# Altium schematic sheet CLP_RV_A.1.SchDoc
size 584 x 431 mm; PageSetup: Record=PageOptions|CenterHorizontal=True|CenterVertical=True|PrintScale=0.96|XCorrection=1.00|YCorrection=1.00|PrintKind=0|BorderSize=5000000|LeftOffset=0|BottomOffset=0|Orientation=2|PaperLength=1000|PaperWidth=1000|Scale=100|PaperSource=7|PrintQuality=600|MediaType=1|DitherType=10|PaperKind=Personal. 1:  8,5  x  11 pol|PrintScaleMode=1
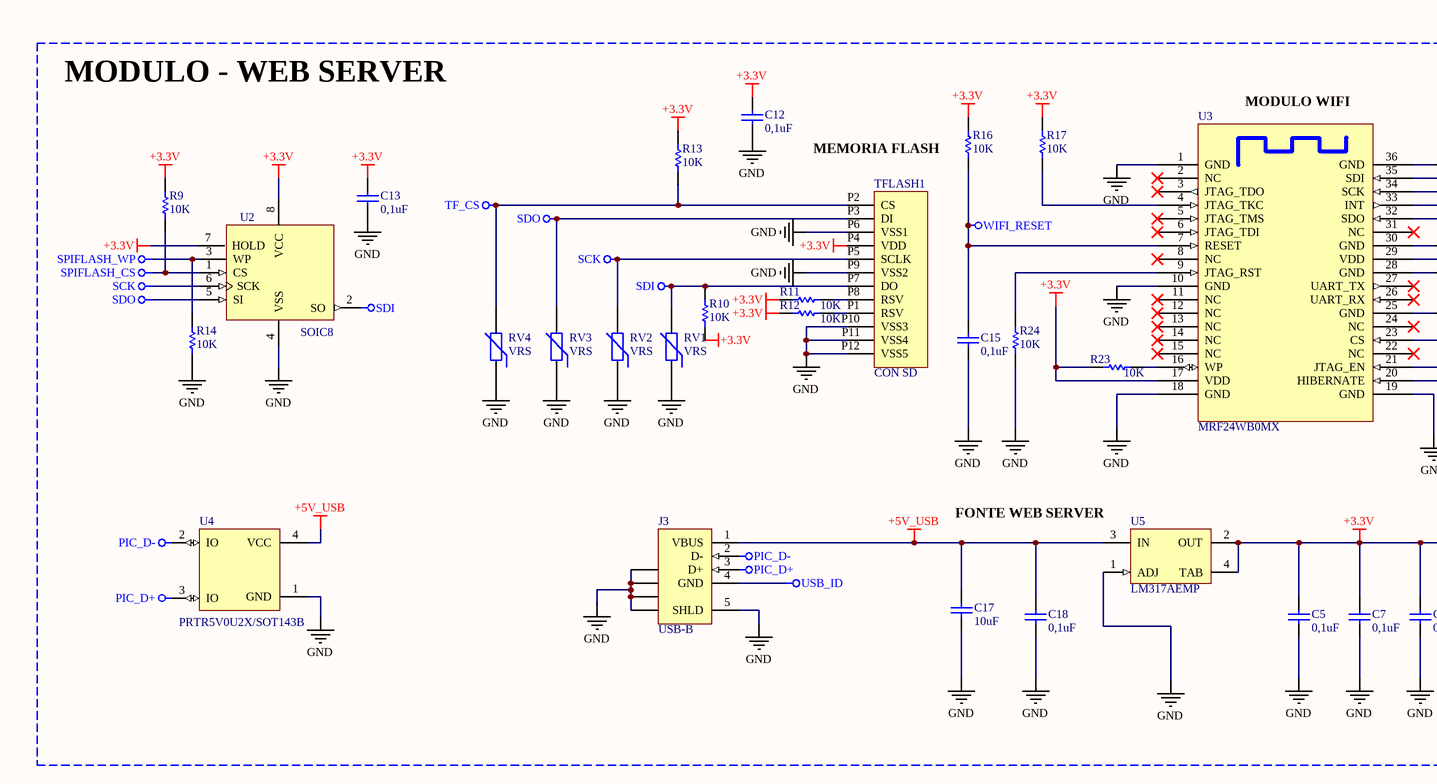
[diagram p0: CLP_RV_A.1.SchDoc, top left]
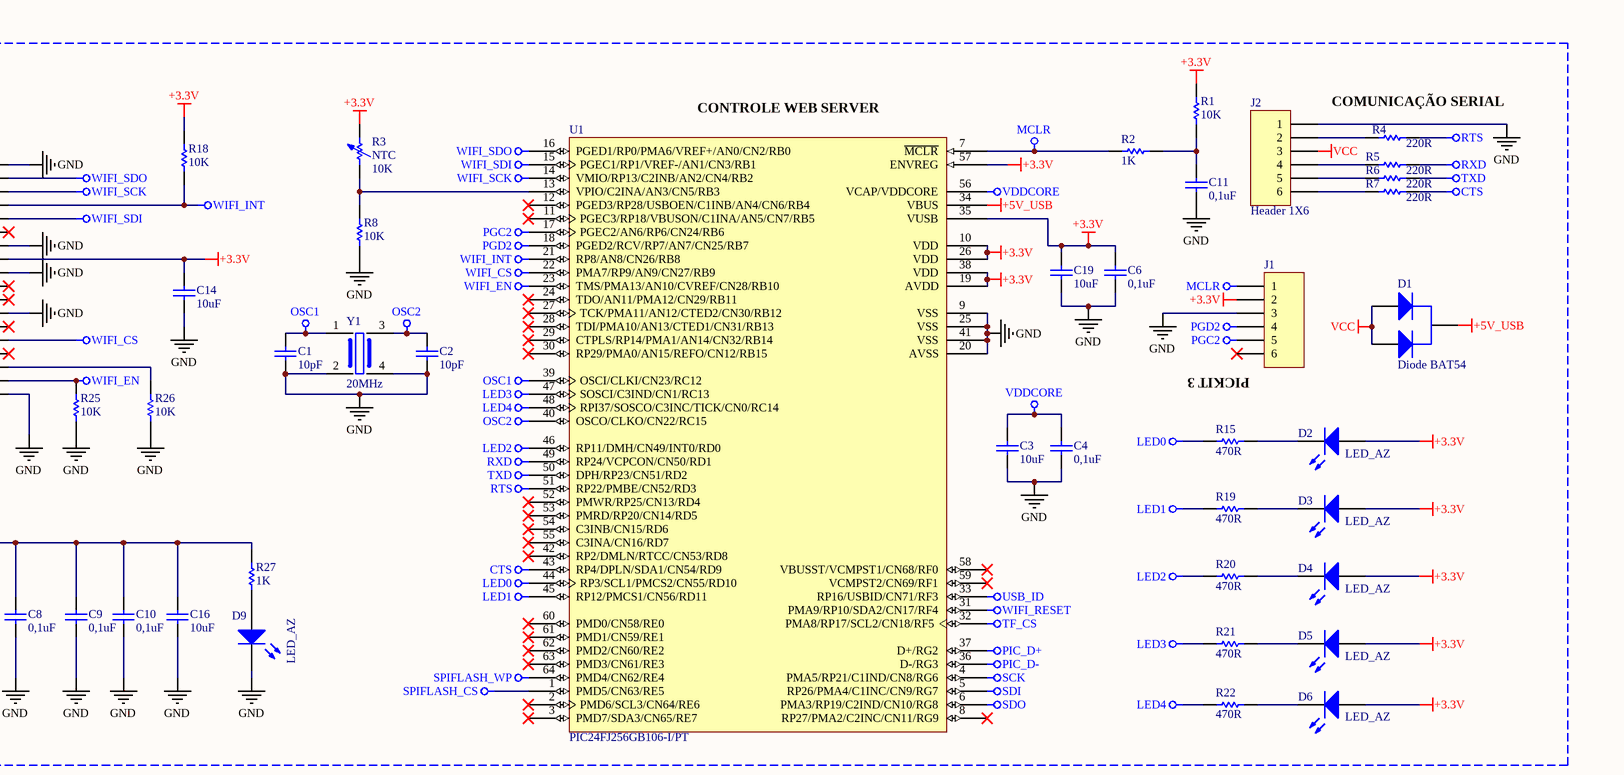
[diagram p1: CLP_RV_A.1.SchDoc, top right]
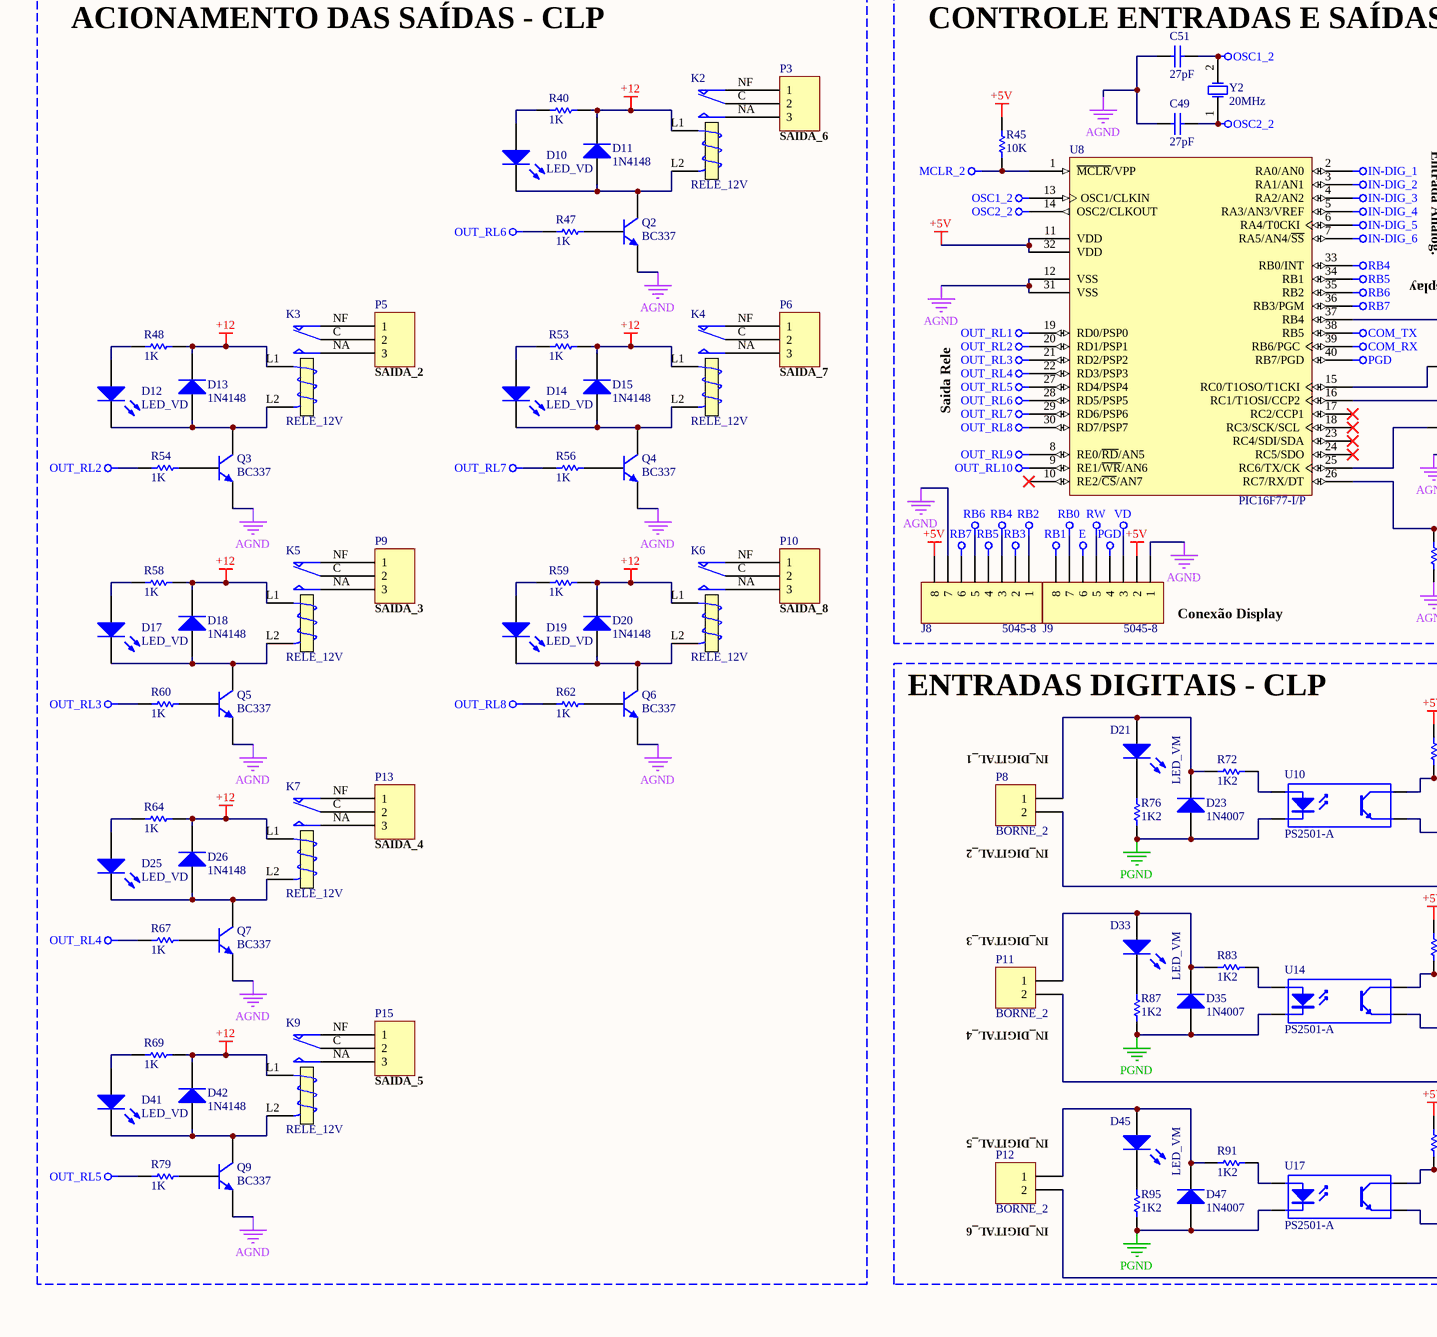
[diagram p2: CLP_RV_A.1.SchDoc, bottom left]
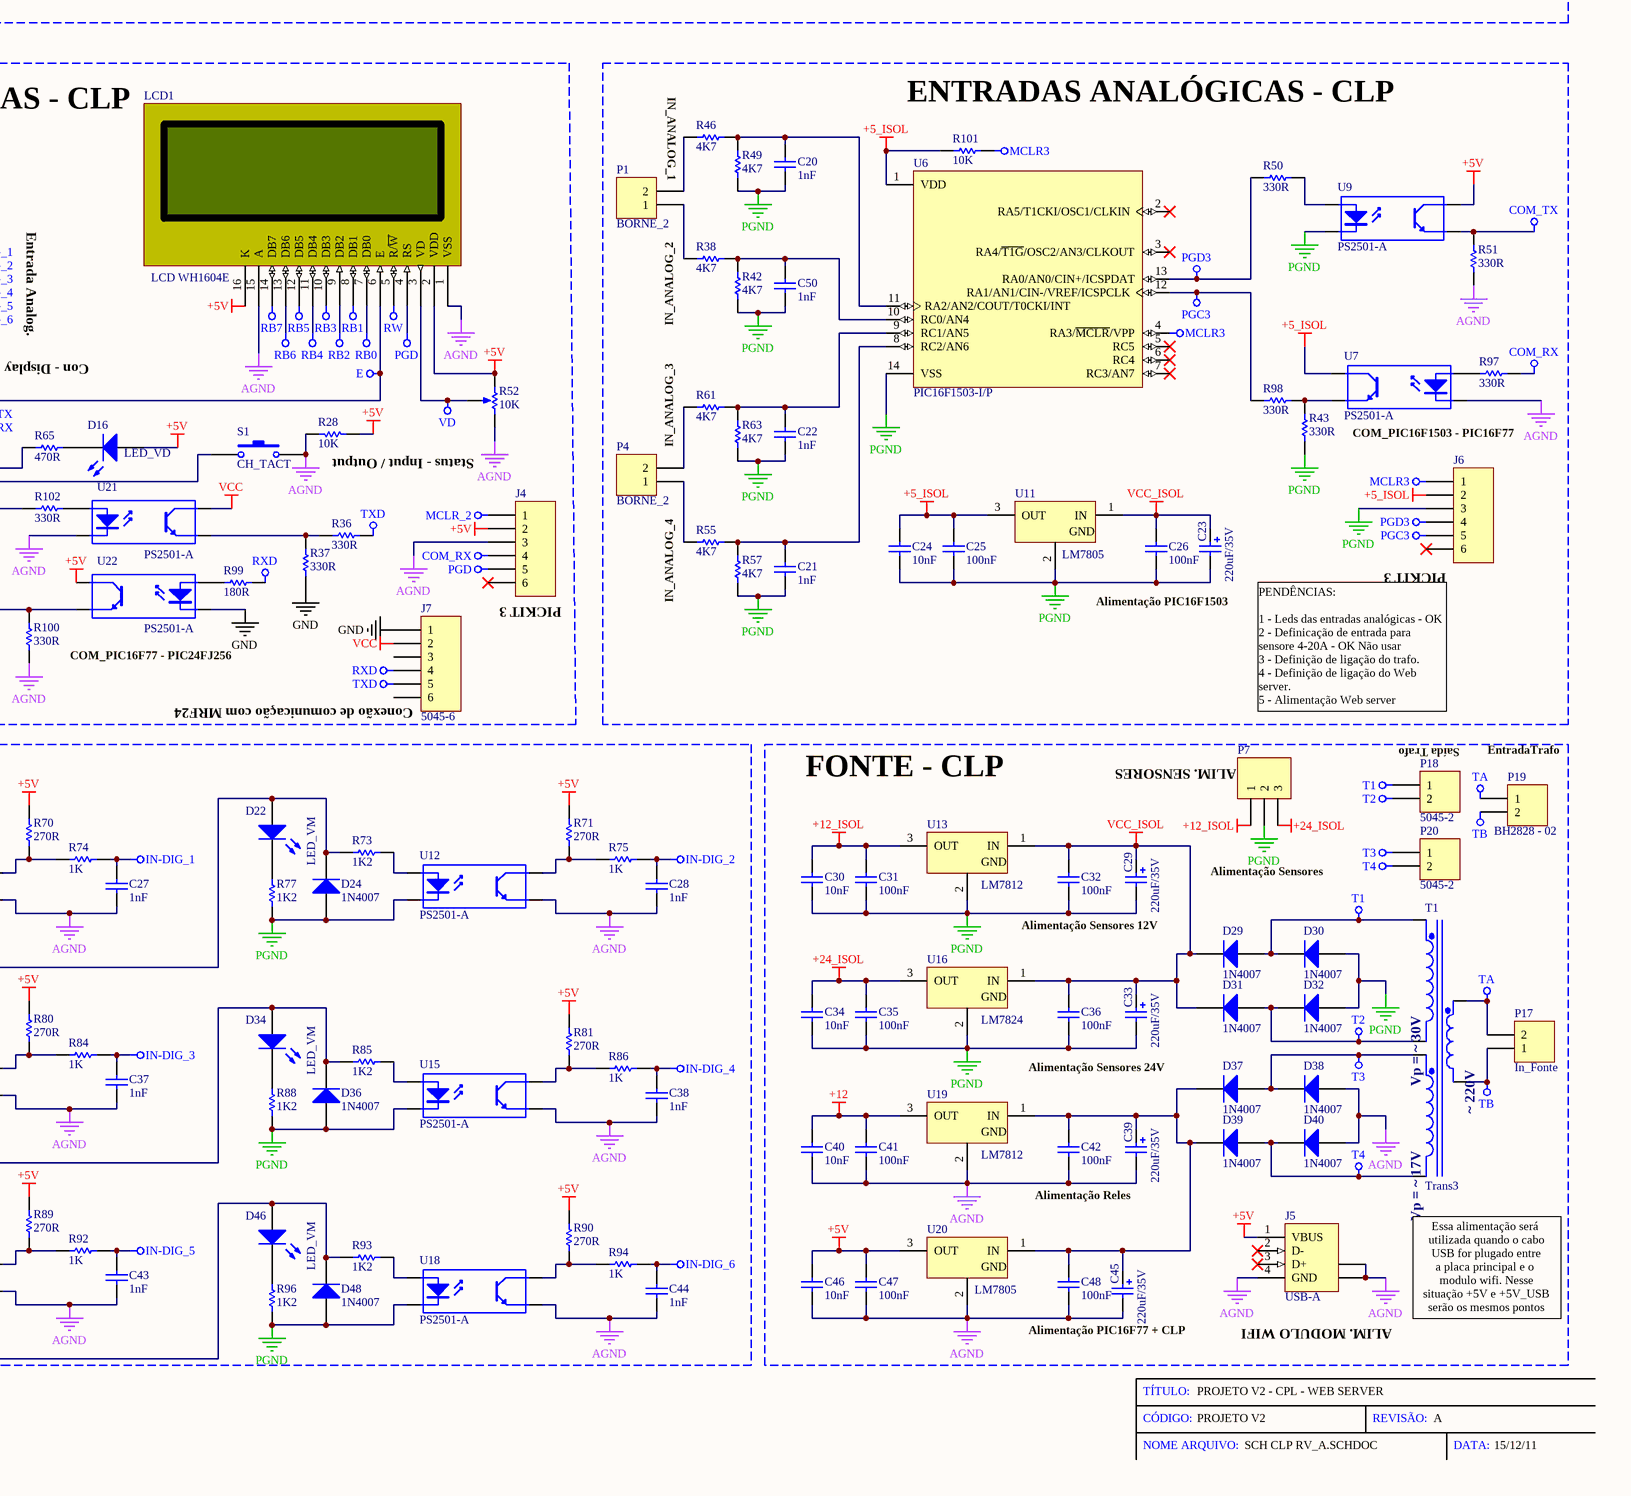
[diagram p3: CLP_RV_A.1.SchDoc, bottom right]

## Parts
C1  10pF  [AR_0603_C]
C2  10pF  [AR_0603_C]
C3  10uF  [AR_0805_C]
C4  0,1uF  [AR_0603_C]
C5  0,1uF  [AR_0603_C]
C6  0,1uF  [AR_0603_C]
C7  0,1uF  [AR_0603_C]
C8  0,1uF  [AR_0603_C]
C9  0,1uF  [AR_0603_C]
C10  0,1uF  [AR_0603_C]
C11  0,1uF  [AR_0603_C]
C12  0,1uF  [AR_0603_C]
C13  0,1uF  [AR_0603_C]
C14  10uF  [AR_0805_C]
C15  0,1uF  [AR_0603_C]
C16  10uF  [AR_0805_C]
C17  10uF  [AR_0805_C]
C18  0,1uF  [AR_0603_C]
C19  10uF  [AR_0805_C]
C20  1nF  [CAP_AX_5_CER]
C21  1nF  [CAP_AX_5_CER]
C22  1nF  [CAP_AX_5_CER]
C23  220uF/35V  [CAP_RD_5_10]
C24  10nF  [CAP_AX_5_CER]
C25  100nF  [CAP_AX_5]
C26  100nF  [CAP_AX_5]
C27  1nF  [CAP_AX_5_CER]
C28  1nF  [CAP_AX_5_CER]
C29  220uF/35V  [CAP_RD_5_10]
C30  10nF  [CAP_AX_5_CER]
C31  100nF  [CAP_AX_5]
C32  100nF  [CAP_AX_5]
C33  220uF/35V  [CAP_RD_5_10]
C34  10nF  [CAP_AX_5_CER]
C35  100nF  [CAP_AX_5]
C36  100nF  [CAP_AX_5]
C37  1nF  [CAP_AX_5_CER]
C38  1nF  [CAP_AX_5_CER]
C39  220uF/35V  [CAP_RD_5_10]
C40  10nF  [CAP_AX_5_CER]
C41  100nF  [CAP_AX_5]
C42  100nF  [CAP_AX_5]
C43  1nF  [CAP_AX_5_CER]
C44  1nF  [CAP_AX_5_CER]
C45  220uF/35V  [CAP_RD_5_10]
C46  10nF  [CAP_AX_5_CER]
C47  100nF  [CAP_AX_5]
C48  100nF  [CAP_AX_5]
C49  27pF  [CAP_AX_5_CER]
C50  1nF  [CAP_AX_5_CER]
C51  27pF  [CAP_AX_5_CER]
D1  Diode BAT54  [AR_SOT23]
D2  LED_AZ  [AR_0603_L_AZ]
D3  LED_AZ  [AR_0603_L_AZ]
D4  LED_AZ  [AR_0603_L_AZ]
D5  LED_AZ  [AR_0603_L_AZ]
D6  LED_AZ  [AR_0603_L_AZ]
D9  LED_AZ  [AR_0603_L_AZ]
D10  LED_VD  [LED_VD]
D11  1N4148  [1N414X]
D12  LED_VD  [LED_VD]
D13  1N4148  [1N414X]
D14  LED_VD  [LED_VD]
D15  1N4148  [1N414X]
D16  LED_VD  [LED_VD]
D17  LED_VD  [LED_VD]
D18  1N4148  [1N414X]
D19  LED_VD  [LED_VD]
D20  1N4148  [1N414X]
D21  LED_VM  [LED_VM]
D22  LED_VM  [LED_VM]
D23  1N4007  [1N400X]
D24  1N4007  [1N400X]
D25  LED_VD  [LED_VD]
D26  1N4148  [1N414X]
D29  1N4007  [1N400X]
D30  1N4007  [1N400X]
D31  1N4007  [1N400X]
D32  1N4007  [1N400X]
D33  LED_VM  [LED_VM]
D34  LED_VM  [LED_VM]
D35  1N4007  [1N400X]
D36  1N4007  [1N400X]
D37  1N4007  [1N400X]
D38  1N4007  [1N400X]
D39  1N4007  [1N400X]
D40  1N4007  [1N400X]
D41  LED_VD  [LED_VD]
D42  1N4148  [1N414X]
D45  LED_VM  [LED_VM]
D46  LED_VM  [LED_VM]
D47  1N4007  [1N400X]
D48  1N4007  [1N400X]
J1  Header 1X6  [BARRA DE PINO RETA 1 X 7]  (value not drawn)
J2  Header 1X6  [BARRA DE PINO RETA 1 X 7]
J3  USB-B  [CON_USB_SMD_B]
J4  PICKIT 3  [BARRA DE PINO RETA 1 X 7]  (value not drawn)
J5  USB-A  [CON_USB_PTH_A]
J6  PICKIT 3  [BARRA DE PINO RETA 1 X 7]  (value not drawn)
J7  5045-6  [BC5045-06]
J8  5045-8  [BC5045-08]
J9  5045-8  [BC5045-08]
K2  RELE_12V  [RELE_M]
K3  RELE_12V  [RELE_M]
K4  RELE_12V  [RELE_M]
K5  RELE_12V  [RELE_M]
K6  RELE_12V  [RELE_M]
K7  RELE_12V  [RELE_M]
K9  RELE_12V  [RELE_M]
LCD1  LCD WH1604E  [WH1604]
P1  BORNE_2  [BORNE_2]
P3  SAIDA_6  [BORNE_3]
P4  BORNE_2  [BORNE_2]
P5  SAIDA_2  [BORNE_3]
P6  SAIDA_7  [BORNE_3]
P7  Alimentação Sensores  [BORNE_3]
P8  BORNE_2  [BORNE_2]
P9  SAIDA_3  [BORNE_3]
P10  SAIDA_8  [BORNE_3]
P11  BORNE_2  [BORNE_2]
P12  BORNE_2  [BORNE_2]
P13  SAIDA_4  [BORNE_3]
P15  SAIDA_5  [BORNE_3]
P17  In_Fonte  [BORNE_2]
P18  5045-2  [BC5045-02]
P19  BH2828 - 02  [BOX_HEAD_2828-02]
P20  5045-2  [BC5045-02]
Q2  BC337  [TO-92]
Q3  BC337  [TO-92]
Q4  BC337  [TO-92]
Q5  BC337  [TO-92]
Q6  BC337  [TO-92]
Q7  BC337  [TO-92]
Q9  BC337  [TO-92]
R1  10K  [AR_0603_R]
R2  1K  [AR_0603_R]
R3  NTC  value 10K  [AR_0603_I]
R4  220R  [AR_0603_R]
R5  220R  [AR_0603_R]
R6  220R  [AR_0603_R]
R7  220R  [AR_0603_R]
R8  10K  [AR_0603_R]
R9  10K  [AR_0603_R]
R10  10K  [AR_0603_R]
R11  10K  [AR_0603_R]
R12  10K  [AR_0603_R]
R13  10K  [AR_0603_R]
R14  10K  [AR_0603_R]
R15  470R  [AR_0603_R]
R16  10K  [AR_0603_R]
R17  10K  [AR_0603_R]
R18  10K  [AR_0603_R]
R19  470R  [AR_0603_R]
R20  470R  [AR_0603_R]
R21  470R  [AR_0603_R]
R22  470R  [AR_0603_R]
R23  10K  [AR_0603_R]
R24  10K  [AR_0603_R]
R25  10K  [AR_0603_R]
R26  10K  [AR_0603_R]
R27  1K  [AR_0603_R]
R28  10K  [R20]
R36  value 330R  [R20]  (hidden comment: 4K7)
R37  value 330R  [R20]  (hidden comment: 4K7)
R38  4K7  [R20]
R40  1K  [R20]
R42  4K7  [R20]
R43  value 330R  [R20]  (hidden comment: 4K7)
R45  10K  [R20]
R46  4K7  [R20]
R47  1K  [R20]
R48  1K  [R20]
R49  4K7  [R20]
R50  value 330R  [R20]  (hidden comment: 4K7)
R51  value 330R  [R20]  (hidden comment: 4K7)
R52  10K  [POT_G]
R53  1K  [R20]
R54  1K  [R20]
R55  4K7  [R20]
R56  1K  [R20]
R57  4K7  [R20]
R58  1K  [R20]
R59  1K  [R20]
R60  1K  [R20]
R61  4K7  [R20]
R62  1K  [R20]
R63  4K7  [R20]
R64  1K  [R20]
R65  value 470R  [R20]  (hidden comment: 4K7)
R67  1K  [R20]
R69  1K  [R20]
R70  value 270R  [R20]  (hidden comment: 4K7)
R71  value 270R  [R20]  (hidden comment: 4K7)
R72  value 1K2  [R20]  (hidden comment: 4K7)
R73  value 1K2  [R20]  (hidden comment: 4K7)
R74  1K  [R20]
R75  1K  [R20]
R76  value 1K2  [R20]  (hidden comment: 4K7)
R77  value 1K2  [R20]  (hidden comment: 4K7)
R79  1K  [R20]
R80  value 270R  [R20]  (hidden comment: 4K7)
R81  value 270R  [R20]  (hidden comment: 4K7)
R83  value 1K2  [R20]  (hidden comment: 4K7)
R84  1K  [R20]
R85  value 1K2  [R20]  (hidden comment: 4K7)
R86  1K  [R20]
R87  value 1K2  [R20]  (hidden comment: 4K7)
R88  value 1K2  [R20]  (hidden comment: 4K7)
R89  value 270R  [R20]  (hidden comment: 4K7)
R90  value 270R  [R20]  (hidden comment: 4K7)
R91  value 1K2  [R20]  (hidden comment: 4K7)
R92  1K  [R20]
R93  value 1K2  [R20]  (hidden comment: 4K7)
R94  1K  [R20]
R95  value 1K2  [R20]  (hidden comment: 4K7)
R96  value 1K2  [R20]  (hidden comment: 4K7)
R97  value 330R  [R20]  (hidden comment: 4K7)
R98  value 330R  [R20]  (hidden comment: 4K7)
R99  180R  [R20]
R100  value 330R  [R20]  (hidden comment: 4K7)
R101  10K  [R20]
R102  value 330R  [R20]  (hidden comment: 4K7)
RV1  VRS  [0402_MOV]
RV2  VRS  [0402_MOV]
RV3  VRS  [0402_MOV]
RV4  VRS  [0402_MOV]
S1  CH_TACT  [PUSH]
T1  Trans3  [TRF_6]
TFLASH1  CON SD  [MEM2060]
U1  PIC24FJ256GB106-I/PT  [AR_TQFP64]
U2  SOIC8  [AR_SO8]
U3  MRF24WB0MX  [MRF24WB0MA]
U4  PRTR5V0U2X/SOT143B  [SOT143B]
U5  LM317AEMP  [SOT223]
U6  PIC16F1503-I/P  [DIP14]
U7  PS2501-A  [DIP-4]
U8  PIC16F77-I/P  [DIP40]
U9  PS2501-A  [DIP-4]
U10  PS2501-A  [DIP-4]
U11  LM7805  [TO220]
U12  PS2501-A  [DIP-4]
U13  LM7812  [TO220]
U14  PS2501-A  [DIP-4]
U15  PS2501-A  [DIP-4]
U16  LM7824  [TO220]
U17  PS2501-A  [DIP-4]
U18  PS2501-A  [DIP-4]
U19  LM7812  [TO220]
U20  LM7805  [TO220]
U21  PS2501-A  [DIP-4]
U22  PS2501-A  [DIP-4]
Y1  20MHz  [XTAL_SMD_KX6]
Y2  20MHz  [XTAL]

## Blocks framed on the sheet
MODULO - WEB SERVER: C1-C19 D1-D6 D9 J1-J3 R1-R27 RV1-RV4 TFLASH1 U1-U5 Y1
ACIONAMENTO DAS SAÍDAS - CLP: D10-D15 D17-D20 D25 D26 D41 D42 K2-K7 K9 P3 P5 P6 P9 P10 P13 P15 Q2-Q7 Q9 R40 R47 R48 R53 R54 R56 R58-R60 R62 R64 R67 R69 R79
CONTROLE ENTRADAS E SAÍDAS - CLP: C49 C51 D16 J4 J7-J9 LCD1 R28 R36 R37 R45 R52 R65 R99 R100 R102 S1 U8 U21 U22 Y2
ENTRADAS ANALÓGICAS - CLP: C20-C26 C50 J6 P1 P4 R38 R42 R43 R46 R49-R51 R55 R57 R61 R63 R97 R98 R101 U6 U7 U9 U11
ENTRADAS DIGITAIS - CLP: C27 C28 C37 C38 C43 C44 D21-D24 D33-D36 D45-D48 P8 P11 P12 R70-R77 R80 R81 R83-R96 U10 U12 U14 U15 U17 U18
FONTE - CLP: C29-C36 C39-C42 C45-C48 D29-D32 D37-D40 J5 P7 P17-P20 T1 U13 U16 U19 U20

## Nets
+3.3V: C5.2 C6.2 C7.2 C8.2 C9.2 C10.2 C12.2 C13.2 C14.2 C16.2 C19.2 D2.1(A) D3.1(A) D4.1(A) D5.1(A) D6.1(A) J1.2 R1.2 R3.2 R9.2 R10.1 R11.1 R12.1 R13.2 R16.2 R17.2 R18.2 R23.2 R27.2 TFLASH1.P4(VDD) U1.10(VDD) U1.19(AVDD) U1.26(VDD) U1.35(VUSB) U1.38(VDD) U1.57(ENVREG) U2.7(HOLD) U2.8(VCC) U3.17(VDD) U3.29(VDD) U5.2(OUT) U5.4(TAB)
+5_ISOL: C24.2 C25.2 J6.2 R101.1 U6.1(VDD) U7.4(C) U11.3(OUT)
+5V: C46.2 C47.2 D16.1(A) J4.2 J5.1(VBUS) J8.8 J9.2 LCD1.2(VDD) LCD1.16(K) R28.2 R45.2 R52.1(TOP) R70.2 R71.2 R80.2 R81.2 R89.2 R90.2 U8.11(VDD) U8.32(VDD) U9.4(C) U20.3(OUT) U22.4(C)
+5V_USB: C17.2 C18.2 D1.3(K) J3.1(VBUS) U1.34(VBUS) U4.4(VCC) U5.3(IN)
+12: C40.2 C41.2 D11.2(K) D13.2(K) D15.2(K) D18.2(K) D20.2(K) D26.2(K) D42.2(K) K2.L1(T1) K3.L1(T1) K4.L1(T1) K5.L1(T1) K6.L1(T1) K7.L1(T1) K9.L1(T1) R40.2 R48.2 R53.2 R58.2 R59.2 R64.2 R69.2 U19.3(OUT)
+12_ISOL: C30.2 C31.2 P7.1 U13.3(OUT)
+24_ISOL: C34.2 C35.2 P7.3 U16.3(OUT)
AGND: C27.1 C28.1 C37.1 C38.1 C39.2 C40.1 C41.1 C42.1 C43.1 C44.1 C45.2 C46.1 C47.1 C48.1 C49.1 C51.1 D38.1(A) D40.1(A) J4.3 J5.4(GND) J5.5(SHLD) J5.6(SHLD) J8.7 J9.1 LCD1.1(VSS) LCD1.15(A) Q2.E Q3.E Q4.E Q5.E Q6.E Q7.E Q9.E R28.1 R51.2 R52.2(BOT) R100.2 S1.2 U7.2(K) U8.12(VSS) U8.31(VSS) U10.3(E) U12.3(E) U14.3(E) U15.3(E) U17.3(E) U18.3(E) U19.2(GND) U20.2(GND) U21.2(K)
COM_RX: J4.4 R97.1 U8.39(RB6/PGC)
COM_TX: R51.1 U8.38(RB5) U9.3(E)
CTS: R7.2 U1.43(RP4/DPLN/SDA1/CN54/RD9)
E: J9.6 LCD1.6(E) U8.37(RB4)
GND: C1.1 C2.1 C3.1 C4.1 C5.1 C6.1 C7.1 C8.1 C9.1 C10.1 C11.1 C12.1 C13.1 C14.1 C15.1 C16.1 C17.1 C18.1 C19.1 D9.2(K) J1.3 J2.1 J3.5(SHLD) J3.6(SHLD) J3.7(SHLD) J3.8(SHLD) J3.9(SHLD) J7.1 R8.1 R14.1 R24.1 R25.1 R26.1 R37.2 RV1.1 RV2.1 RV3.1 RV4.1 TFLASH1.P6(VSS1) TFLASH1.P9(VSS2) TFLASH1.P10(VSS3) TFLASH1.P11(VSS4) TFLASH1.P12(VSS5) U1.9(VSS) U1.20(AVSS) U1.25(VSS) U1.41(VSS) U2.4(VSS) U3.1(GND) U3.10(GND) U3.18(GND) U3.19(GND) U3.25(GND) U3.28(GND) U3.30(GND) U3.36(GND) U4.1(GND) U5.1(ADJ) U22.2(K) Y1.2(OSC2) Y1.4(OSC4)
IN-DIG_1: C27.2 R74.2 U8.2(RA0/AN0)
IN-DIG_2: C28.2 R75.2 U8.3(RA1/AN1)
IN-DIG_3: C37.2 R84.2 U8.4(RA2/AN2)
IN-DIG_4: C38.2 R86.2 U8.5(RA3/AN3/VREF)
IN-DIG_5: C43.2 R92.2 U8.6(RA4/T0CKI)
IN-DIG_6: C44.2 R94.2 U8.7(RA5/AN4/~{SS})
LED0: R15.1 U1.44(RP3/SCL1/PMCS2/CN55/RD10)
LED1: R19.1 U1.45(RP12/PMCS1/CN56/RD11)
LED2: R20.1 U1.46(RP11/DMH/CN49/INT0/RD0)
LED3: R21.1 U1.47(SOSCI/C3IND/CN1/RC13)
LED4: R22.1 U1.48(RPI37/SOSCO/C3INC/TICK/CN0/RC14)
MCLR: J1.1 R2.1 U1.7(~{MCLR})
MCLR3: J6.1 R101.2 U6.4(RA3/~{MCLR}/VPP)
MCLR_2: J4.1 R45.1 U8.1(~{MCLR}/VPP)
OSC1: C1.2 U1.39(OSCI/CLKI/CN23/RC12) Y1.1(OSC1)
OSC1_2: C51.2 U8.13(OSC1/CLKIN) Y2.2(OSC2)
OSC2: C2.2 U1.40(OSCO/CLKO/CN22/RC15) Y1.3(OSC3)
OSC2_2: C49.2 U8.14(OSC2/CLKOUT) Y2.1(OSC1)
OUT_RL1: U8.19(RD0/PSP0)
OUT_RL2: R54.1 U8.20(RD1/PSP1)
OUT_RL3: R60.1 U8.21(RD2/PSP2)
OUT_RL4: R67.1 U8.22(RD3/PSP3)
OUT_RL5: R79.1 U8.27(RD4/PSP4)
OUT_RL6: R47.1 U8.28(RD5/PSP5)
OUT_RL7: R56.1 U8.29(RD6/PSP6)
OUT_RL8: R62.1 U8.30(RD7/PSP7)
OUT_RL9: U8.8(RE0/~{RD}/AN5)
OUT_RL10: U8.9(RE1/~{WR}/AN6)
PGC2: J1.5 U1.17(PGEC2/AN6/RP6/CN24/RB6)
PGC3: J6.5 R98.2 U6.12(RA1/AN1/CIN-/VREF/ICSPCLK)
PGD: J4.5 J9.4 LCD1.4(RS) U8.40(RB7/PGD)
PGD2: J1.4 U1.18(PGED2/RCV/RP7/AN7/CN25/RB7)
PGD3: J6.4 R50.2 U6.13(RA0/AN0/CIN+/ICSPDAT)
PGND: C20.1 C21.1 C22.1 C23.2 C24.1 C25.1 C26.1 C29.2 C30.1 C31.1 C32.1 C33.2 C34.1 C35.1 C36.1 C50.1 D23.1(A) D24.1(A) D30.1(A) D32.1(A) D35.1(A) D36.1(A) D47.1(A) D48.1(A) J6.3 P7.2 R42.1 R43.1 R49.1 R57.2 R63.2 R76.1 R77.1 R87.1 R88.1 R95.1 R96.1 U6.14(VSS) U9.2(K) U10.2(K) U11.2(GND) U12.2(K) U13.2(GND) U14.2(K) U15.2(K) U16.2(GND) U17.2(K) U18.2(K)
PIC_D+: J3.3(D+) U1.37(D+/RG2) U4.3(IO)
PIC_D-: J3.2(D-) U1.36(D-/RG3) U4.2(IO)
RB0: J9.7 LCD1.7(DB0)
RB1: J9.8 LCD1.8(DB1)
RB2: J8.1 LCD1.9(DB2)
RB3: J8.2 LCD1.10(DB3)
RB4: J8.3 LCD1.11(DB4) U8.33(RB0/INT)
RB5: J8.4 LCD1.12(DB5) U8.34(RB1)
RB6: J8.5 LCD1.13(DB6) U8.35(RB2)
RB7: J8.6 LCD1.14(DB7) U8.36(RB3/PGM)
RTS: R4.2 U1.51(RP22/PMBE/CN52/RD3)
RW: J9.5 LCD1.5(R/~{W})
RXD: J7.4 R5.2 R99.2 U1.49(RP24/VCPCON/CN50/RD1)
SCK: RV2.2 TFLASH1.P5(SCLK) U1.4(PMA5/RP21/C1IND/CN8/RG6) U2.6(SCK)
SDI: R10.2 RV1.2 TFLASH1.P7(DO) U1.5(RP26/PMA4/C1INC/CN9/RG7) U2.2(SO)
SDO: RV3.2 TFLASH1.P3(DI) U1.6(PMA3/RP19/C2IND/CN10/RG8) U2.5(SI)
SPIFLASH_CS: R9.1 U1.1(PMD5/CN63/RE5) U2.1(CS)
SPIFLASH_WP: R14.2 U1.64(PMD4/CN62/RE4) U2.3(WP)
T1: D29.1(A) D30.2(K) P18.1 T1.3(Sec1+)
T2: D31.1(A) D32.2(K) P18.2 T1.4(Sec1-)
T3: D37.1(A) D38.2(K) P20.1 T1.5(Sec2+)
T4: D39.1(A) D40.2(K) P20.2 T1.6(Sec2-)
TA: P17.2 P19.1 T1.1(Pri+)
TB: P17.1 P19.2 T1.2(Pri-)
TF_CS: R13.1 RV4.2 TFLASH1.P2(CS) U1.32(PMA8/RP17/SCL2/CN18/RF5)
TXD: J7.5 R6.2 R36.1 U1.50(DPH/RP23/CN51/RD2)
USB_ID: J3.4(GND) U1.33(RP16/USBID/CN71/RF3)
VCC: D1.1(A) D1.2(A) J2.3 J7.2 U21.4(C)
VCC_ISOL: C23.1 C26.2 C29.1 C32.2 C33.1 C36.2 D29.2(K) D31.2(K) U11.1(IN) U13.1(IN) U16.1(IN)
VD: J9.3 LCD1.3(VD) R52.3(TAP)
VDDCORE: C3.2 C4.2 U1.56(VCAP/VDDCORE)
WIFI_CS: U1.22(PMA7/RP9/AN9/CN27/RB9) U3.23(CS)
WIFI_EN: R25.2 U1.23(TMS/PMA13/AN10/CVREF/CN28/RB10) U3.20(HIBERNATE)
WIFI_INT: R18.1 U1.21(RP8/AN8/CN26/RB8) U3.33(INT)
WIFI_RESET: C15.2 R16.1 U1.31(PMA9/RP10/SDA2/CN17/RF4) U3.7(RESET)
WIFI_SCK: U1.14(VMIO/RP13/C2INB/AN2/CN4/RB2) U3.34(SCK)
WIFI_SDI: U1.15(PGEC1/RP1/VREF-/AN1/CN3/RB1) U3.32(SDO)
WIFI_SDO: U1.16(PGED1/RP0/PMA6/VREF+/AN0/CN2/RB0) U3.35(SDI)
NetC11_2: C11.2 R1.1 R2.2
NetC20_2: C20.2 R46.2 R49.2 U6.11(RA2/AN2/COUT/T0CKI/INT)
NetC21_2: C21.2 R55.2 R57.1 U6.8(RC2/AN6)
NetC22_2: C22.2 R61.2 R63.1 U6.9(RC1/AN5)
NetC39_1: C39.1 C42.2 C45.1 C48.2 D37.2(K) D39.2(K) U19.1(IN) U20.1(IN)
NetC50_2: C50.2 R38.2 R42.2 U6.10(RC0/AN4)
NetD2_2: D2.2(K) R15.2
NetD3_2: D3.2(K) R19.2
NetD4_2: D4.2(K) R20.2
NetD5_2: D5.2(K) R21.2
NetD6_2: D6.2(K) R22.2
NetD9_1: D9.1(A) R27.1
NetD10_1: D10.1(A) R40.1
NetD10_2: D10.2(K) D11.1(A) K2.L2(T2) Q2.C
NetD12_1: D12.1(A) R48.1
NetD12_2: D12.2(K) D13.1(A) K3.L2(T2) Q3.C
NetD14_1: D14.1(A) R53.1
NetD14_2: D14.2(K) D15.1(A) K4.L2(T2) Q4.C
NetD16_2: D16.2(K) R65.2
NetD17_1: D17.1(A) R58.1
NetD17_2: D17.2(K) D18.1(A) K5.L2(T2) Q5.C
NetD19_1: D19.1(A) R59.1
NetD19_2: D19.2(K) D20.1(A) K6.L2(T2) Q6.C
NetD21_1: D21.1(A) D23.2(K) P8.1 R72.1
NetD21_2: D21.2(K) R76.2
NetD22_1: D22.1(A) D24.2(K) P8.2 R73.1
NetD22_2: D22.2(K) R77.2
NetD25_1: D25.1(A) R64.1
NetD25_2: D25.2(K) D26.1(A) K7.L2(T2) Q7.C
NetD33_1: D33.1(A) D35.2(K) P11.1 R83.1
NetD33_2: D33.2(K) R87.2
NetD34_1: D34.1(A) D36.2(K) P11.2 R85.1
NetD34_2: D34.2(K) R88.2
NetD41_1: D41.1(A) R69.1
NetD41_2: D41.2(K) D42.1(A) K9.L2(T2) Q9.C
NetD45_1: D45.1(A) D47.2(K) P12.1 R91.1
NetD45_2: D45.2(K) R95.2
NetD46_1: D46.1(A) D48.2(K) P12.2 R93.1
NetD46_2: D46.2(K) R96.2
NetJ2_2: J2.2 R4.1
NetJ2_4: J2.4 R5.1
NetJ2_5: J2.5 R6.1
NetJ2_6: J2.6 R7.1
NetK2_C: K2.C(COM) P3.2
NetK2_NA: K2.NA(NO) P3.3
NetK2_NF: K2.NF(NC) P3.1
NetK3_C: K3.C(COM) P5.2
NetK3_NA: K3.NA(NO) P5.3
NetK3_NF: K3.NF(NC) P5.1
NetK4_C: K4.C(COM) P6.2
NetK4_NA: K4.NA(NO) P6.3
NetK4_NF: K4.NF(NC) P6.1
NetK5_C: K5.C(COM) P9.2
NetK5_NA: K5.NA(NO) P9.3
NetK5_NF: K5.NF(NC) P9.1
NetK6_C: K6.C(COM) P10.2
NetK6_NA: K6.NA(NO) P10.3
NetK6_NF: K6.NF(NC) P10.1
NetK7_C: K7.C(COM) P13.2
NetK7_NA: K7.NA(NO) P13.3
NetK7_NF: K7.NF(NC) P13.1
NetK9_C: K9.C(COM) P15.2
NetK9_NA: K9.NA(NO) P15.3
NetK9_NF: K9.NF(NC) P15.1
NetP1_1: P1.1 R38.1
NetP1_2: P1.2 R46.1
NetP4_1: P4.1 R55.1
NetP4_2: P4.2 R61.1
NetQ2_B: Q2.B R47.2
NetQ3_B: Q3.B R54.2
NetQ4_B: Q4.B R56.2
NetQ5_B: Q5.B R60.2
NetQ6_B: Q6.B R62.2
NetQ7_B: Q7.B R67.2
NetQ9_B: Q9.B R79.2
NetR3_1: R3.1 R8.2 U1.13(VPIO/C2INA/AN3/CN5/RB3)
NetR11_2: R11.2 TFLASH1.P8(RSV)
NetR12_2: R12.2 TFLASH1.P1(RSV)
NetR17_1: R17.1 U3.4(JTAG_TKC)
NetR23_1: R23.1 U3.16(WP)
NetR24_2: R24.2 U3.9(JTAG_RST)
NetR26_2: R26.2 U3.21(JTAG_EN)
NetR36_2: R36.2 R37.1 U21.3(E)
NetR43_2: R43.2 R98.1 U7.3(E)
NetR50_1: R50.1 U9.1(A)
NetR65_1: R65.1 U8.15(RC0/T1OSO/T1CKI)
NetR70_1: R70.1 R74.1 U10.4(C)
NetR71_1: R71.1 R75.1 U12.4(C)
NetR72_2: R72.2 U10.1(A)
NetR73_2: R73.2 U12.1(A)
NetR80_1: R80.1 R84.1 U14.4(C)
NetR81_1: R81.1 R86.1 U15.4(C)
NetR83_2: R83.2 U14.1(A)
NetR85_2: R85.2 U15.1(A)
NetR89_1: R89.1 R92.1 U17.4(C)
NetR90_1: R90.1 R94.1 U18.4(C)
NetR91_2: R91.2 U17.1(A)
NetR93_2: R93.2 U18.1(A)
NetR97_2: R97.2 U7.1(A)
NetR99_1: R99.1 U22.1(A)
NetR100_1: R100.1 U8.26(RC7/RX/DT) U22.3(E)
NetR102_1: R102.1 U21.1(A)
NetR102_2: R102.2 U8.25(RC6/TX/CK)
NetS1_1: S1.1 U8.16(RC1/T1OSI/CCP2)

Not connected (* = marked no-connect by the designer): J1 6*; J4 6*; J5 2(D-)* 3(D+)*; J6 6*; J7 3 6; U1 2(PMD6/SCL3/CN64/RE6)* 3(PMD7/SDA3/CN65/RE7)* 8(RP27/PMA2/C2INC/CN11/RG9)* 11(PGEC3/RP18/VBUSON/C1INA/AN5/CN7/RB5)* 12(PGED3/RP28/USBOEN/C1INB/AN4/CN6/RB4)* 24(TDO/AN11/PMA12/CN29/RB11)* 27(TCK/PMA11/AN12/CTED2/CN30/RB12)* 28(TDI/PMA10/AN13/CTED1/CN31/RB13)* 29(CTPLS/RP14/PMA1/AN14/CN32/RB14)* 30(RP29/PMA0/AN15/REFO/CN12/RB15)* 42(RP2/DMLN/RTCC/CN53/RD8)* 52(PMWR/RP25/CN13/RD4)* 53(PMRD/RP20/CN14/RD5)* 54(C3INB/CN15/RD6)* 55(C3INA/CN16/RD7)* 58(VBUSST/VCMPST1/CN68/RF0)* 59(VCMPST2/CN69/RF1)* 60(PMD0/CN58/RE0)* 61(PMD1/CN59/RE1)* 62(PMD2/CN60/RE2)* 63(PMD3/CN61/RE3)*; U3 2(NC)* 3(JTAG_TDO)* 5(JTAG_TMS)* 6(JTAG_TDI)* 8(NC)* 11(NC)* 12(NC)* 13(NC)* 14(NC)* 15(NC)* 22(NC)* 24(NC)* 26(UART_RX)* 27(UART_TX)* 31(NC)*; U6 2(RA5/T1CKI/OSC1/CLKIN)* 3(RA4/~{T1G}/OSC2/AN3/CLKOUT)* 5(RC5)* 6(RC4)* 7(RC3/AN7)*; U8 10(RE2/~{CS}/AN7)* 17(RC2/CCP1)* 18(RC3/SCK/SCL)* 23(RC4/SDI/SDA)* 24(RC5/SDO)*

## Notes on the sheet
- MODULO WIFI
- (near U1) CONTROLE WEB SERVER
- COMUNICAÇÃO SERIAL
- MEMORIA FLASH
- (near J1) PICKIT 3
- FONTE WEB SERVER
- IN_ANALOG_1
- INTERFACE IHM
- Entrada Analog.
- Con - Display
- (near R38) IN_ANALOG_2
- Status - Input / Output
- IN_ANALOG_3
- COM_PIC16F1503 - PIC16F77
- Saida Rele
- (near J6) PICKIT 3
- (near J4) PICKIT 3
- (near R55) IN_ANALOG_4
- Alimentação PIC16F1503
- (near J9) Conexão Display
- COM_PIC16F77 - PIC24FJ256
- (near J7) Conexão de comunicação com MRF24
- PENDÊNCIAS:
  1 - Leds das entradas analógicas - OK
  2 - Definicação de entrada para sensore 4-20A - OK Não usar
  3 - Definição de ligação do trafo.
  4 - Definição de ligação do Web server.
  5 - Alimentação Web server
  6 - Capacitores de Desacoplamento - Micros
- (near P7) ALIM. SENSORES
- (near P18) Saída Trafo
- (near P19) EntradaTrafo
- (near P8) IN_DIGITAL_1
- (near P8) IN_DIGITAL_2
- Alimentação Sensores 12V
- (near P11) IN_DIGITAL_3
- (near T1) Vp = ~ 30V
- (near P11) IN_DIGITAL_4
- Alimentação Sensores 24V
- (near T1) ~ 220V
- (near T1) Vp = ~ 17V
- (near P12) IN_DIGITAL_5
- Alimentação Reles
- (near P12) IN_DIGITAL_6
- (near J5) ALIM. MODULO WIFI
- (near T1) Essa alimentação será
  utilizada quando o cabo
  USB for plugado entre
  a placa principal e o
  modulo wifi. Nesse
  situação +5V e +5V_USB
  serão os mesmos pontos
- Alimentação PIC16F77 + CLP
- TÍTULO:
- PROJETO V2 - CPL - WEB SERVER
- CÓDIGO:
- NOME ARQUIVO:
- PROJETO V2
- SCH CLP RV_A.SCHDOC
- REVISÃO:
- A
- DATA:
- 15/12/11

## Library data of the parts
C1 C2 = CAP 0603 10pF - SMD: Published: 8-Jun-2000; LatestRevisionDate: 17-Jul-2002; LatestRevisionNote: Re-released for DXP Platform.; PackageReference: RAD-0.3; Publisher: Altium Limited; PackageDescription: Radial Cap, Thru-Hole; 2 Leads; 0.3 in Pin Spacing; Value: 10pF
C3 C14 C16 C17 C19 = CAP 0805 10uF - SMD: Published: 8-Jun-2000; LatestRevisionDate: 17-Jul-2002; LatestRevisionNote: Re-released for DXP Platform.; PackageReference: RAD-0.3; Publisher: Altium Limited; PackageDescription: Radial Cap, Thru-Hole; 2 Leads; 0.3 in Pin Spacing; Value: 10uF
C4-C13 C15 C18 = CAP 0603 0,1uF - SMD: Published: 8-Jun-2000; LatestRevisionDate: 17-Jul-2002; LatestRevisionNote: Re-released for DXP Platform.; PackageReference: RAD-0.3; Publisher: Altium Limited; PackageDescription: Radial Cap, Thru-Hole; 2 Leads; 0.3 in Pin Spacing; Value: 0,1uF
C20-C22 C27 C28 C37 C38 C43 C44 C50 = CAP CER 1nF / 25V: Published: 8-Jun-2000; LatestRevisionDate: 17-Jul-2002; LatestRevisionNote: Re-released for DXP Platform.; PackageReference: RAD-0.3; Publisher: Altium Limited; PackageDescription: Radial Cap, Thru-Hole; 2 Leads; 0.3 in Pin Spacing; Value: 1nF
C23 C29 C33 C39 C45 = CAP ELCO 220uF / 35V: Published: 8-Jun-2000; LatestRevisionDate: 17-Jul-2002; LatestRevisionNote: Re-released for DXP Platform.; PackageReference: RB7.6-15; Publisher: Altium Limited; PackageDescription: Polarized Capacitor (Radial); 2 Leads; Value: 220uF/35V
C24 C30 C34 C40 C46 = CAP CER 10nF / 25V: Published: 8-Jun-2000; LatestRevisionDate: 17-Jul-2002; LatestRevisionNote: Re-released for DXP Platform.; PackageReference: RAD-0.3; Publisher: Altium Limited; PackageDescription: Radial Cap, Thru-Hole; 2 Leads; 0.3 in Pin Spacing; Value: 10nF
C25 C26 C31 C32 C35 C36 C41 C42 C47 C48 = CAP CER 100nF / 63V: Published: 8-Jun-2000; LatestRevisionDate: 17-Jul-2002; LatestRevisionNote: Re-released for DXP Platform.; PackageReference: RAD-0.3; Publisher: Altium Limited; PackageDescription: Radial Cap, Thru-Hole; 2 Leads; 0.3 in Pin Spacing; Value: 100nF
C49 C51 = CAP CER 27pF / 25V: Published: 8-Jun-2000; LatestRevisionDate: 17-Jul-2002; LatestRevisionNote: Re-released for DXP Platform.; PackageReference: RAD-0.3; Publisher: Altium Limited; PackageDescription: Radial Cap, Thru-Hole; 2 Leads; 0.3 in Pin Spacing; Value: 27pF
D1 = Diode BAT54: Low-Loss RF Switching Diode
D2-D6 D9 = LED 0603 AZUL - SMD: Published: 8-Jun-2000; LatestRevisionDate: 17-Jul-2002; LatestRevisionNote: Re-released for DXP Platform.; PackageVersion: Feb-2002; PackageReference: 3.2X1.6X1.1; Publisher: Altium Limited; PackageDescription: SM LED; 2 Flat Leads
D10 D12 D14 D16 D17 D19 D25 D41 = LED_VD_3MM: Published: 8-Jun-2000; LatestRevisionDate: 17-Jul-2002; LatestRevisionNote: Re-released for DXP Platform.; PackageVersion: Feb-2002; PackageReference: 3.2X1.6X1.1; Publisher: Altium Limited; PackageDescription: SM LED; 2 Flat Leads
D11 D13 D15 D18 D20 D26 D42 = DIODO 1N4148: Published: 8-Jun-2000; LatestRevisionDate: 17-Jul-2002; LatestRevisionNote: Re-released for DXP Platform.; DatasheetVersion: 1998; PackageVersion: Aug-1999; PackageReference: DO-41; Publisher: Altium Limited; PackageDescription: Diode, Axial; Body 5.2 x 2.7 mm (LxDia. max), Lead Dia. 0.86 mm (max); Code_JEDEC: DO-204-AL; ComponentLink1Description: Manufacturer Link; ComponentLink1URL: http://www.fairchildsemi.com/; ComponentLink2Description: Datasheet; ComponentLink2URL: http://www.fairchildsemi.com/ds/1N%2F1N4001.pdf
D21 D22 D33 D34 D45 D46 = LED_VM_3MM: Published: 8-Jun-2000; LatestRevisionDate: 17-Jul-2002; LatestRevisionNote: Re-released for DXP Platform.; PackageVersion: Feb-2002; PackageReference: 3.2X1.6X1.1; Publisher: Altium Limited; PackageDescription: SM LED; 2 Flat Leads
D23 D24 D29-D32 D35-D40 D47 D48 = DIODO 1N4007: Published: 8-Jun-2000; LatestRevisionDate: 17-Jul-2002; LatestRevisionNote: Re-released for DXP Platform.; DatasheetVersion: 1998; PackageVersion: Aug-1999; PackageReference: DO-41; Publisher: Altium Limited; PackageDescription: Diode, Axial; Body 5.2 x 2.7 mm (LxDia. max), Lead Dia. 0.86 mm (max); Code_JEDEC: DO-204-AL; ComponentLink1Description: Manufacturer Link; ComponentLink1URL: http://www.fairchildsemi.com/; ComponentLink2Description: Datasheet; ComponentLink2URL: http://www.fairchildsemi.com/ds/1N%2F1N4001.pdf
J1 J2 J4 J6 = Barra de Pino 1X6: LatestRevisionDate: 17-Jul-2002; LatestRevisionNote: Re-released for DXP Platform.; Publisher: Altium Limited
J3 = CON_USB_SMD_B: USB 2.0, Right Angle, SMT, B Type, Receptacle, 5 Position, Black; ContactMaterial: Copper Alloy; ContactPlating: Gold (30); PCB_Layout: Complies with manufacturer's recommendation.; DrillSize: Corresponds to nominal value.; PanelGround: Without; Published: 15-Jul-2004; DatasheetDocument: 27-Jun-2003; PackageDocument: 27-Jun-2003; PackageReference: 440247; Publisher: Altium Limited; HousingMaterial: Thermoplastic; ComponentLink1Description: Manufacturer Link; ComponentLink1URL: http://www.tycoelectronics.com/; ComponentLink2Description: Packaging Specification; ComponentLink2URL: http://ecommas.tycoelectronics.com/commerce/DocumentDelivery/DDEController?Action=showdoc&DocId=Customer+Drawing%7F440247%7FD%7Fpdf%7FEnglish%7FC_440247_D.pdf
J5 = CON_USB_PTH_A: USB 1.1, Right Angle, Thru-Hole, Reverse Type, Receptacle, 4 Position, Black; ContactMaterial: Copper Alloy; ContactPlating: Gold Flash; TerminationLength: 2.40mm [0.094in.]; PCB_Layout: Complies with manufacturer's recommendation.; DrillSize: Corresponds to nominal value.; PanelGround: Without; Published: 15-Jul-2004; DatasheetDocument: 18-Mar-2004; PackageDocument: 18-Mar-2004; PackageReference: 440068; Publisher: Altium Limited; HousingMaterial: Glass-Filled Thermoplastic; ComponentLink1Description: Manufacturer Link; ComponentLink1URL: http://www.tycoelectronics.com/; ComponentLink2Description: Packaging Specification; ComponentLink2URL: http://ecommas.tycoelectronics.com/commerce/DocumentDelivery/DDEController?Action=showdoc&DocId=Customer+Drawing%7F440068%7FD%7Ftif%7FEnglish%7FC_440068_D.tif
J7 = BASE CONEC. 5045-6: LatestRevisionDate: 17-Jul-2002; LatestRevisionNote: Re-released for DXP Platform.; Publisher: Altium Limited
J8 J9 = BASE CONEC. 5045-8: LatestRevisionDate: 17-Jul-2002; LatestRevisionNote: Re-released for DXP Platform.; Publisher: Altium Limited
K2-K7 K9 = RELE 12V: Published: 8-Jun-2000; LatestRevisionDate: 17-Jul-2002; LatestRevisionNote: Re-released for DXP Platform.; PackageReference: MODULE5B; Publisher: Altium Limited
LCD1 = LCD WH1604E: Display Crístal Líquido WH1604E - 16X4
P1 P4 P8 P11 P12 P17 = BORNE_MOLEX_2: LatestRevisionDate: 17-Jul-2002; LatestRevisionNote: Re-released for DXP Platform.; Publisher: Altium Limited
P3 P5-P7 P9 P10 P13 P15 = BORNE_MOLEX_3: LatestRevisionDate: 17-Jul-2002; LatestRevisionNote: Re-released for DXP Platform.; Publisher: Altium Limited
P18 P20 = BASE CONEC. 5045-2: LatestRevisionDate: 17-Jul-2002; LatestRevisionNote: Re-released for DXP Platform.; Publisher: Altium Limited
P19 = Box Header BH2828 - 02: LatestRevisionDate: 17-Jul-2002; LatestRevisionNote: Re-released for DXP Platform.; Publisher: Altium Limited
Q2-Q7 Q9 = TR BC337: Published: 8-Jun-2000; LatestRevisionDate: 17-Jul-2002; LatestRevisionNote: Re-released for DXP Platform.; PackageReference: TO-226-AA; Publisher: Altium Limited; PackageDescription: TO, Flat Index; 3 In-Line, Axial Leads; Body Dia. 4.8mm; Leads 0.55 x 0.51 mm (max); Code_JEDEC: TO-226-AA
R1 R8-R14 R16-R18 R23-R26 = RES 10K 0603 - SMD: Published: 8-Jun-2000; LatestRevisionDate: 17-Jul-2002; LatestRevisionNote: Re-released for DXP Platform.; PackageReference: AXIAL-0.3; Publisher: Altium Limited; PackageDescription: Axial Device, Thru-Hole; 2 Leads; 0.3 in Pin Spacing; Value: 10K
R2 R27 = RES 1K 0603 - SMD: Published: 8-Jun-2000; LatestRevisionDate: 17-Jul-2002; LatestRevisionNote: Re-released for DXP Platform.; PackageReference: AXIAL-0.3; Publisher: Altium Limited; PackageDescription: Axial Device, Thru-Hole; 2 Leads; 0.3 in Pin Spacing; Value: 1K
R3 = Res Adj1: Variable Resistor; Set Position: 0.5; Published: 8-Jun-2000; LatestRevisionDate: 17-Jul-2002; LatestRevisionNote: Re-released for DXP Platform.; PackageReference: AXIAL-0.7; Publisher: Altium Limited; PackageDescription: Axial Device, Thru-Hole; 2 Leads; 0.7 in Pin Spacing
R4-R7 = RES 220R 0603 - SMD: Published: 8-Jun-2000; LatestRevisionDate: 17-Jul-2002; LatestRevisionNote: Re-released for DXP Platform.; PackageReference: AXIAL-0.3; Publisher: Altium Limited; PackageDescription: Axial Device, Thru-Hole; 2 Leads; 0.3 in Pin Spacing; Value: 220R
R15 R19-R22 = RES 470R 0603 - SMD: Published: 8-Jun-2000; LatestRevisionDate: 17-Jul-2002; LatestRevisionNote: Re-released for DXP Platform.; PackageReference: AXIAL-0.3; Publisher: Altium Limited; PackageDescription: Axial Device, Thru-Hole; 2 Leads; 0.3 in Pin Spacing; Value: 470R
R28 R45 R101 = RES 10K 1/8W - PTH: Published: 8-Jun-2000; LatestRevisionDate: 17-Jul-2002; LatestRevisionNote: Re-released for DXP Platform.; PackageReference: AXIAL-0.3; Publisher: Altium Limited; PackageDescription: Axial Device, Thru-Hole; 2 Leads; 0.3 in Pin Spacing; Value: 10K
R36 R37 R43 R50 R51 R97 R98 R100 R102 = RES 330R 1/8W - PTH: Published: 8-Jun-2000; LatestRevisionDate: 17-Jul-2002; LatestRevisionNote: Re-released for DXP Platform.; PackageReference: AXIAL-0.3; Publisher: Altium Limited; PackageDescription: Axial Device, Thru-Hole; 2 Leads; 0.3 in Pin Spacing
R38 R42 R46 R49 R55 R57 R61 R63 = RES 4K7 1/8W - PTH: Published: 8-Jun-2000; LatestRevisionDate: 17-Jul-2002; LatestRevisionNote: Re-released for DXP Platform.; PackageReference: AXIAL-0.3; Publisher: Altium Limited; PackageDescription: Axial Device, Thru-Hole; 2 Leads; 0.3 in Pin Spacing; Value: 4K7
R40 R47 R48 R53 R54 R56 R58-R60 R62 R64 R67 R69 R74 R75 R79 R84 R86 R92 R94 = RES 1K 1/8W - PTH: Published: 8-Jun-2000; LatestRevisionDate: 17-Jul-2002; LatestRevisionNote: Re-released for DXP Platform.; PackageReference: AXIAL-0.3; Publisher: Altium Limited; PackageDescription: Axial Device, Thru-Hole; 2 Leads; 0.3 in Pin Spacing; Value: 1K
R52 = Potenciometro 10K Bourns: Sim Note: Enter the Resistance value and the set point into parameter fields.; Set Position: 0.5; Published: 8-Jun-2000; LatestRevisionDate: 17-Jul-2002; LatestRevisionNote: Re-released for DXP Platform.; PackageReference: VR5; Publisher: Altium Limited; PackageDescription: Variable Resistor, Thru-Hole; 3 Leads; Value: 10K
R65 = RES 470R 1/8W - PTH: Published: 8-Jun-2000; LatestRevisionDate: 17-Jul-2002; LatestRevisionNote: Re-released for DXP Platform.; PackageReference: AXIAL-0.3; Publisher: Altium Limited; PackageDescription: Axial Device, Thru-Hole; 2 Leads; 0.3 in Pin Spacing
R70 R71 R80 R81 R89 R90 = RES 270R 1/8W - PTH: Published: 8-Jun-2000; LatestRevisionDate: 17-Jul-2002; LatestRevisionNote: Re-released for DXP Platform.; PackageReference: AXIAL-0.3; Publisher: Altium Limited; PackageDescription: Axial Device, Thru-Hole; 2 Leads; 0.3 in Pin Spacing
R72 R73 R76 R77 R83 R85 R87 R88 R91 R93 R95 R96 = RES 1K2 1/8W - PTH: Published: 8-Jun-2000; LatestRevisionDate: 17-Jul-2002; LatestRevisionNote: Re-released for DXP Platform.; PackageReference: AXIAL-0.3; Publisher: Altium Limited; PackageDescription: Axial Device, Thru-Hole; 2 Leads; 0.3 in Pin Spacing
R99 = RES 180R 1/8W - PTH: Published: 8-Jun-2000; LatestRevisionDate: 17-Jul-2002; LatestRevisionNote: Re-released for DXP Platform.; PackageReference: AXIAL-0.3; Publisher: Altium Limited; PackageDescription: Axial Device, Thru-Hole; 2 Leads; 0.3 in Pin Spacing; Value: 180R
RV1-RV4 = VARISTOR 0402 - SMD: Published: 24-Mar-1999; LatestRevisionDate: 29-May-2009; LatestRevisionNote: IPC-7351 Footprint Added.; PackageVersion: Mar-2003; PackageReference: 6-0805; Publisher: Altium Limited; PackageDescription: Chip Resistor 0805 Case Size; Code_IPC: RESC2012
S1 = CHAVE TACTIL RIGHT: Published: 24-Mar-1999; LatestRevisionDate: 17-Jul-2002; LatestRevisionNote: Re-released for DXP Platform.; PackageReference: SPST-2; Publisher: Altium Limited; PackageDescription: Switch; 2 Leads
T1 = Trans3: Three-winding Transformer (Non-Ideal); Sim Note: Enter the turns ratios, Core loss resistance, Magnetising Reactance, Leakage Reactances and Resistances referred to the primary side into the parameter fields.; Published: 25-Jan-2001; LatestRevisionDate: 17-Jul-2002; LatestRevisionNote: Re-released for DXP Platform.; PackageReference: TRF_6; Publisher: Altium Limited; PackageDescription: Transformer; 6 Leads
TFLASH1 = CON SD CARD MEN2060 - MOLEX: MICRO SD MEMORY CARD CONNECTOR PUSH-PUSH SMT, CARD ENTRY NORMAL 1,90MM PROFILE - MOLEX MEN2060; LatestRevisionDate: 17-Jul-2002; LatestRevisionNote: Re-released for DXP Platform.; Publisher: Altium Limited
U1 = PIC24FJ256GB106-I/PT: General Purpose 16-Bit Flash Microcontroller with USB On-The-Go, 256KB Flash, 16KB SRAM, 64-Pin TQFP, Industrial Temperature; Published: 29-Jan-2009; DatasheetVersion: revB, Mar-2008; PackageVersion: revAW, Oct-2008; PackageReference: TQFP-PT64; Publisher: Altium Limited; PackageDescription: 64-Lead Thin Plastic Quad Flat Pack (PT) - 10x10x1mm Body, 2.00mm [TQFP]; Code_JEDEC: MS-026; ComponentLink1Description: Manufacturer Link; ComponentLink1URL: http://www.microchip.com; ComponentLink2Description: Datasheet; ComponentLink2URL: http://ww1.microchip.com/downloads/en/DeviceDoc/39897b.pdf; ComponentLink3Description: Packaging Specification; ComponentLink3URL: http://ww1.microchip.com/downloads/en/PackagingSpec/00049AW.pdf
U2 = SOIC8: EPCS1 Series, In-system programmable 3.3V serial configuration device, 8-Pin SOIC, 1-Megabit, Industrial Grade; Configures: Cyclone II, Stratix II, & Cyclone Devices; Published: 17-Sep-2003; LatestRevisionDate: 13-Apr-2006; LatestRevisionNote: IPC-7351 Footprint Added.; DatasheetVersion: ver2.0, Oct-2003; PackageVersion: ver13.0, May-2005; PackageReference: SOIC8; Publisher: Altium Limited; PackageDescription: 8-Pin Small Outline Integrated Circuit Package (SOIC8); Code_JEDEC: MS-012-AA; Code_IPC: SOIC127P600-8; ComponentLink1Description: Manufacturer Link; ComponentLink1URL: http://www.altera.com/products/devices/config/cfg-index.html; ComponentLink2Description: Configuration Handbook; ComponentLink2URL: http://www.altera.com/literature/hb/cfg/config_handbook.pdf; ComponentLink3Description: Pinout Specification; ComponentLink3URL: http://www.altera.com/literature/hb/cfg/cyc_c51014.pdf; ComponentLink4Description: Packaging Specification; ComponentLink4URL: http://www.altera.com/literature/ds/dspkg.pdf
U3 = MRF24WB0MX: 2.4 GHz, IEEE Std. 802.11b RF Transceiver Module
U4 = PRTR5V0U2X/SOT143B: Voltage Supervisor with Manual Reset Input, 4-Pin SOT-143, PRTR5V0U2X/SOT143B
U5 = LM317AEMP: 3-Terminal Adjustable Regulator; Manufacturer: National Semiconductor; CompType: LDO IC; PackageTopMarking: XYTT*N07A; PowerWise: N; Published: 4-Dec-2008; DatasheetVersion: Apr-2007; PackageVersion: revB, Apr-2003; PackageReference: MP04A; Publisher: Altium Limited; PackageDescription: Molded SOT-223, 6.50 x 3.56 x 1.6mm Body, 4 Lead, 2.3mm Pitch; PartNumber: LM317AEMP; RoHS: O; PinCount: 4; DigiKeyPartNumber: LM317AEMPCT-ND; Code_JEDEC: TO-261-AA; Code_IPC: SOT223-4; ComponentLink1Description: LM317 Datasheet; ComponentLink1URL: http://www.national.com/ds/LM/LM317.pdf; ComponentLink2Description: LM317 Web Page; ComponentLink2URL: http://www.national.com/pf/LM/LM317.html; ComponentLink3Description: MP04A Package Page; ComponentLink3URL: http://www.national.com/packaging/folders/mp04a.html
U6 = PIC16F1503-I/P: FLASH-Based 8-Bit CMOS Microcontroller, 10-Bit A/D, 1K (x14-Bit words) FLASH, 64 Bytes SRAM, 14-Pin PDIP, 2.0 to 5.5V Supply Range, Extended Temperature; FirstPublished: 11-Oct-2004; LatestRevisionDate: 29-Jan-2009; LatestRevisionNote: Sch. layout revised. 3D Model Removed.; DatasheetVersion: revE, Mar-2007; PackageVersion: revBB, Aug-2009; PackageReference: PDIP300-P14; Publisher: Altium Limited; PackageDescription: 14-Lead Plastic Dual In-Line (P) - 300 mil Body [PDIP]; Supplier 1: Digi-Key; Supplier 2: Newark; Supplier Part Number 2: 92C4550; ComponentLink1Description: Datasheet; ComponentLink1URL: http://ww1.microchip.com/downloads/en/DeviceDoc/40039E.pdf; ComponentLink2Description: Packaging Specification; ComponentLink2URL: http://www.microchip.com/stellent/groups/techpub_sg/documents/packagingspec/en012702.pdf; ComponentLink3Description: Microchip.com Home; ComponentLink3URL: http://www.microchip.com/
U7 U9 U10 U12 U14 U15 U17 U18 U21 U22 = CI OPTO ACOPLADOR PS25010-A: Published: 24-Mar-1999; LatestRevisionDate: 04-Mar-2005; LatestRevisionNote: Sch pins 3 & 4 Swapped.; DatasheetVersion: Nov-2003; PackageReference: DIP-4; Publisher: Altium Limited
U8 = PIC16F77-I/P: 8-bit CMOS FLASH Microcontroller, 8K (x14-Bit words) Program Memory, 368 Bytes Data Memory, 40-Pin PDIP, Standard VDD Range, Industrial Temperature; Published: 29-Jan-2009; DatasheetVersion: revB, 2001; PackageVersion: revAW, Oct-2008; PackageReference: PDIP600-P40; Publisher: Altium Limited; PackageDescription: 40-Lead Plastic Dual In-Line (P) - 600 mil Body [PDIP]; ComponentLink1Description: Manufacturer Link; ComponentLink1URL: http://www.microchip.com; ComponentLink2Description: Datasheet; ComponentLink2URL: http://ww1.microchip.com/downloads/en/DeviceDoc/30325b.pdf; ComponentLink3Description: Packaging Specification; ComponentLink3URL: http://ww1.microchip.com/downloads/en/PackagingSpec/00049AW.pdf
U11 U20 = CI LM7805: Note: Pin 2 is electrically connected to TAB; Published: 17-Jul-2002; DatasheetVersion: 1988; PackageReference: 221A-04; Publisher: Altium Limited; PackageDescription: TO, Thru-Hole, Vertical, Heatsink Mounted; 3 In-Line Leads; Pitch 2.54 mm; Code_JEDEC: TO-262-AA; ComponentLink1Description: Manufacturer Link; ComponentLink1URL: http://www.onsemi.com/site/products/taxonomy/0,4438,503,00.html; ComponentLink2Description: Datasheet; ComponentLink2URL: http://www.onsemi.com/pub/Collateral/MC7800-D.PDF
U13 U19 = CI LM7812: Note: Pin 2 is electrically connected to TAB; Published: 17-Jul-2002; DatasheetVersion: 1988; PackageReference: 221A-04; Publisher: Altium Limited; PackageDescription: TO, Thru-Hole, Vertical, Heatsink Mounted; 3 In-Line Leads; Pitch 2.54 mm; Code_JEDEC: TO-262-AA; ComponentLink1Description: Manufacturer Link; ComponentLink1URL: http://www.onsemi.com/site/products/taxonomy/0,4438,503,00.html; ComponentLink2Description: Datasheet; ComponentLink2URL: http://www.onsemi.com/pub/Collateral/MC7800-D.PDF
U16 = CI LM7824: Note: Pin 2 is electrically connected to TAB; Published: 17-Jul-2002; DatasheetVersion: 1988; PackageReference: 221A-04; Publisher: Altium Limited; PackageDescription: TO, Thru-Hole, Vertical, Heatsink Mounted; 3 In-Line Leads; Pitch 2.54 mm; Code_JEDEC: TO-262-AA; ComponentLink1Description: Manufacturer Link; ComponentLink1URL: http://www.onsemi.com/site/products/taxonomy/0,4438,503,00.html; ComponentLink2Description: Datasheet; ComponentLink2URL: http://www.onsemi.com/pub/Collateral/MC7800-D.PDF
Y1 = XTAL: CRISTAL OC. 20MHz; Published: 8-Jun-2000; LatestRevisionDate: 17-Jul-2002; LatestRevisionNote: Re-released for DXP Platform.; PackageReference: R38; Publisher: Altium Limited; PackageDescription: Crystal, Thru-Hole; 2 Leads; Body 3.1 x 8.2 mm (Dia.xH)
Y2 = CRISTAL OCIL. 20MHz: Published: 8-Jun-2000; LatestRevisionDate: 17-Jul-2002; LatestRevisionNote: Re-released for DXP Platform.; PackageReference: R38; Publisher: Altium Limited